# Altium schematic sheet FMC_Test_Module_main.SchDoc: FMC Test Module - Main
size A3; Author: mayerph; DrawnBy: mayerph; Organization: IIS; Revision: PA; SheetNumber: 1; SheetTotal: 3
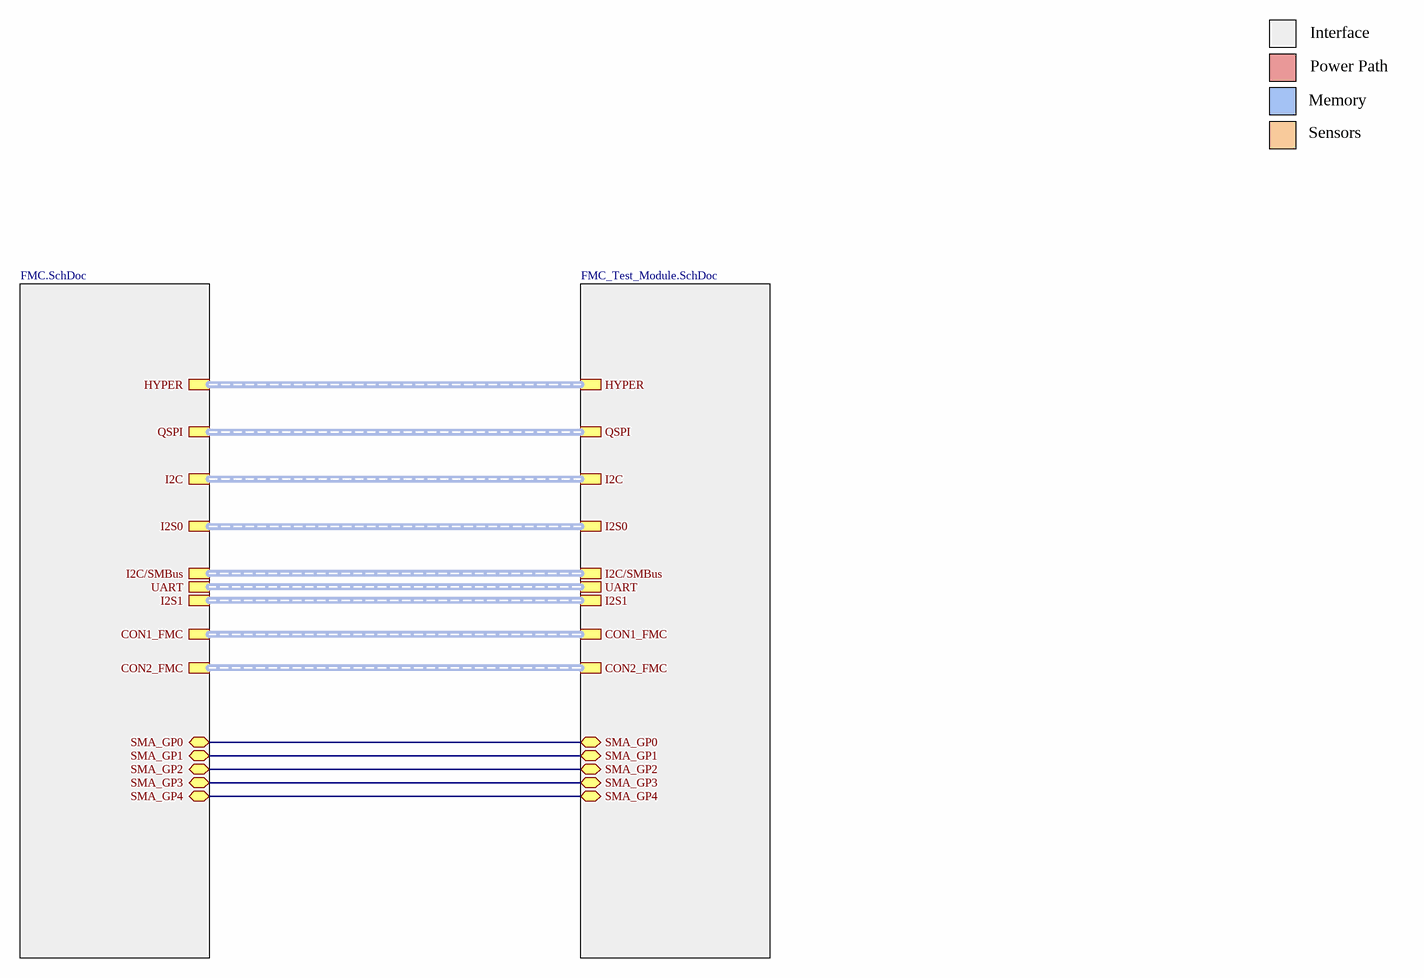
[diagram p0: FMC_Test_Module_main.SchDoc]

## Sub-sheets
FMC = FMC.SchDoc: HYPER, QSPI, I2C, I2S0, I2C/SMBus, UART, I2S1, CON1_FMC, CON2_FMC, SMA_GP2 (bidir), SMA_GP3 (bidir), SMA_GP0 (bidir), SMA_GP1 (bidir), SMA_GP4 (bidir)
TEST = FMC_Test_Module.SchDoc: HYPER, QSPI, I2C, I2S0, I2C/SMBus, UART, I2S1, CON1_FMC, CON2_FMC, SMA_GP3 (bidir), SMA_GP4 (bidir), SMA_GP2 (bidir), SMA_GP0 (bidir), SMA_GP1 (bidir)

## Nets
(unnamed): sheet FMC/SMA_GP2, sheet TEST/SMA_GP2
(unnamed): sheet FMC/SMA_GP3, sheet TEST/SMA_GP3
(unnamed): sheet FMC/SMA_GP0, sheet TEST/SMA_GP0
(unnamed): sheet FMC/SMA_GP1, sheet TEST/SMA_GP1
(unnamed): sheet FMC/SMA_GP4, sheet TEST/SMA_GP4

## Buses and harness runs
harness sheet FMC/CON1_FMC = sheet TEST/CON1_FMC
harness sheet FMC/CON2_FMC = sheet TEST/CON2_FMC
harness sheet FMC/HYPER = sheet TEST/HYPER
harness sheet FMC/I2C = sheet TEST/I2C
harness sheet FMC/I2C/SMBus = sheet TEST/I2C/SMBus
harness sheet FMC/I2S0 = sheet TEST/I2S0
harness sheet FMC/I2S1 = sheet TEST/I2S1
harness sheet FMC/QSPI = sheet TEST/QSPI
harness sheet FMC/UART = sheet TEST/UART

## Notes on the sheet
- Interface
- Memory
- Power Path
- Sensors
- 1
- 2
- 3
- 4
- 5
- 6
- 7
- 8
- A
- B
- C
- D
- Project:
- Date:
- Drawing number:
- Rev:
- Format:
- A3
- Drawn by:
- Laboratory:
- Page
- Sheet:
- of
- File: